# Altium schematic sheet Display.SchDoc: Bluetooth Gateway
size A; CheckedBy: QUOCTHANG; DrawnBy: DONGKHOA; Revision: V1.0.0; SheetNumber: 9; SheetTotal: 10
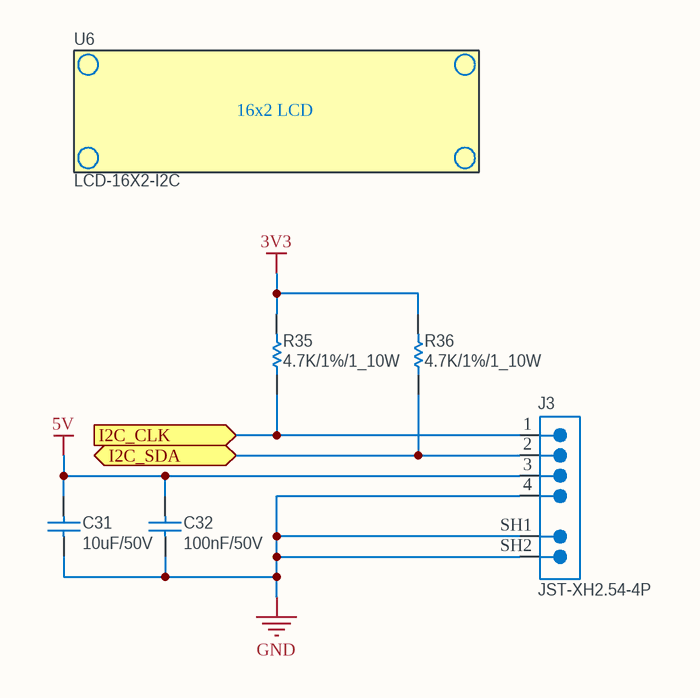
[diagram p0: Display.SchDoc]

## Parts
C31  10uF/50V  [CAP_0805]
C32  100nF/50V  [CAP_0805]
J3  JST-XH2.54-4P  [JST-XH2.54-4P]
R35  4.7K/1%/1_10W  [Resistor_0603]
R36  4.7K/1%/1_10W  [Resistor_0603]
U6  LCD-16X2-I2C  [MODULE_LCD-16X2]

## Ports
I2C_CLK (in, see Overview_Schematic[4A], MCU[2B]), I2C_SDA (bidir, see Overview_Schematic[4A], MCU[3B])

## Nets
3V3: R35.2 R36.2
5V: C31.2 C32.2 J3.3
GND: C31.1 C32.1 J3.4 J3.SH1(SHIELD) J3.SH2(SHIELD)
I2C_CLK: J3.1 R35.1 ; port I2C_CLK
I2C_SDA: J3.2 R36.1 ; port I2C_SDA

## Notes on the sheet
- Project Name
- Size
- A4
- Revision
- Checked By:
- Drawn By:
- Date:
- File:
- Last Modified:
- Sheet
- of
- (in symbol LCD-16X2-I2C) 16x2 LCD

## Library data of the parts
C31 = Ceramic_Cap_10uF_50V_0805: CAP, size 0805, 10uF, 50V; Supply Part Number: Tụ Gốm 0805 10uF 50V; Supply Name: Thegioiic; Datasheet: *; Supply URL: https://www.thegioiic.com/tu-gom-0805-10uf-50v
C32 = Ceramic_Cap_100nF_50V_0805: CAP, size 0805, 100nF, 50V; Supply Part Number: Tụ Gốm 0805 100nF (0.1uF) 50V; Supply Name: Thegioiic; Datasheet: *; Supply URL: https://www.thegioiic.com/tu-gom-0805-100nf-0-1uf-50v
J3 = JST-XH2.54-4P: XH2.54mm 4 Pin, SMD; Supply Part Number: Đầu XH2.54mm 4 Chân Dán SMD Nằm Ngang; Supply Name: Thegioiic; Supply URL: https://www.thegioiic.com/dau-xh2-54mm-4-chan-dan-smd-nam-ngang
R35 R36 = Res_4.7K_0603_1%: Resistor 0603 4.7KOhm 1% 1_10W; Supply Part Number: Điện Trở 4.7 KOhm 0603 1%; Supply Name: Thegioiic; Supply URL: https://www.thegioiic.com/dien-tro-4-7-kohm-0603-1-
U6 = LCD-16X2-I2C: Display Development Tools 16x2 Black on Green Char LCD w Backlight; Supply Part Number: LCD 1602 Nền Xanh Lá Chữ Đen 5V Kèm I2C Driver; Supply Name: Thegioiic; Datasheet: https://www.snapeda.com/parts/LCD-16X2/Gravitech/view-part/?ref=snap; Supply URL: https://www.thegioiic.com/lcd-1602-nen-xanh-la-chu-den-5v-kem-i2c-driver